# Altium schematic sheet ArduHoop.SchDoc
size B
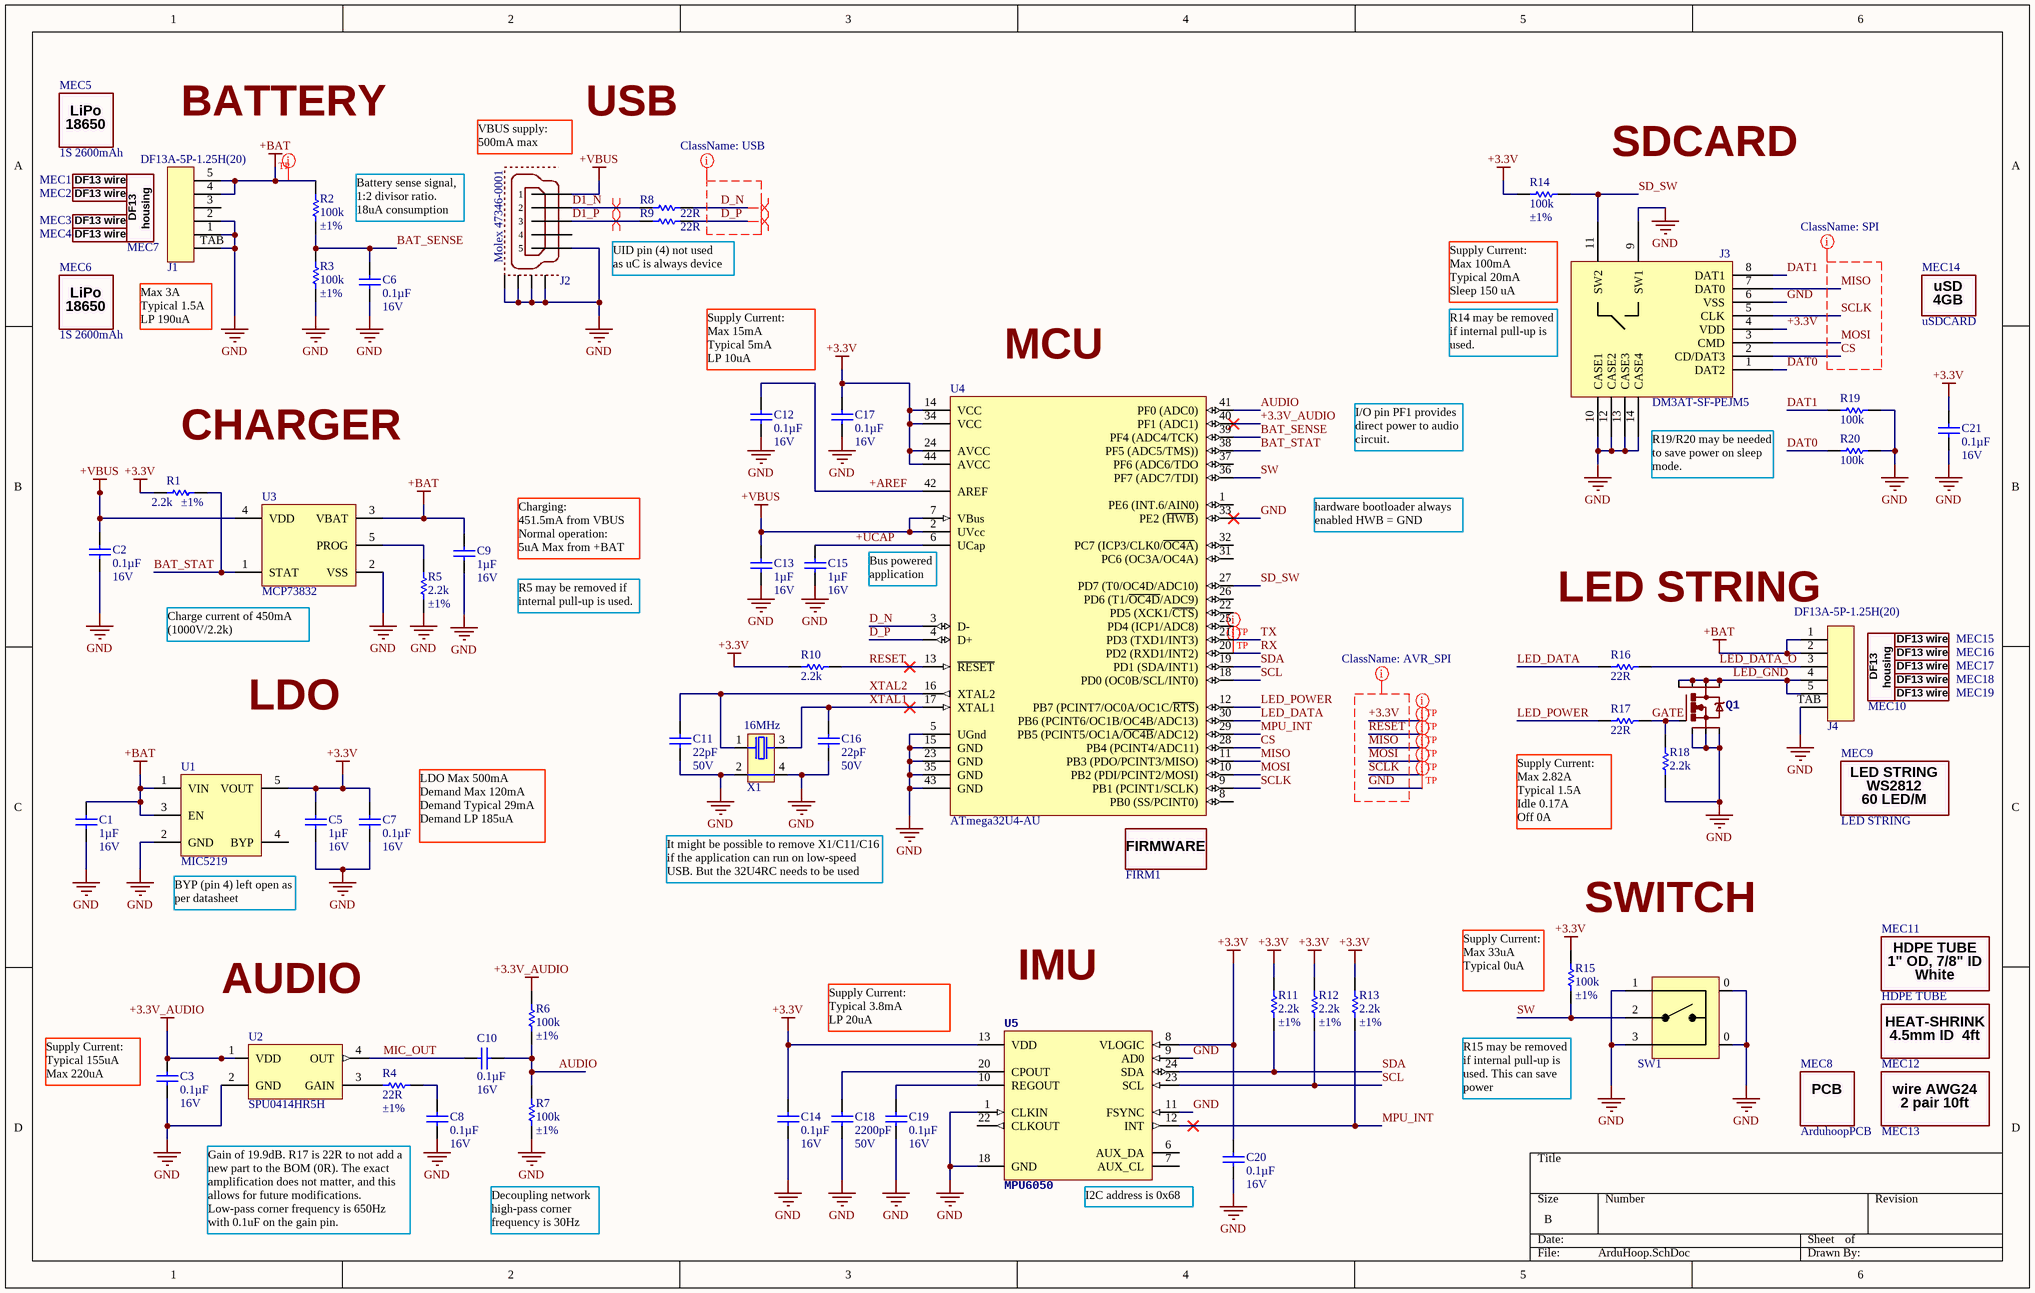
[diagram p0: ArduHoop.SchDoc]

## Parts
C1  value 1µF  Voltage: 16V  [C0603]  (hidden comment: CAP)
C2  value 0.1µF  Voltage: 16V  [C0603]  (hidden comment: CAP)
C3  value 0.1µF  Voltage: 16V  [C0603]  (hidden comment: CAP)
C5  value 1µF  Voltage: 16V  [C0603]  (hidden comment: CAP)
C6  value 0.1µF  Voltage: 16V  [C0603]  (hidden comment: CAP)
C7  value 0.1µF  Voltage: 16V  [C0603]  (hidden comment: CAP)
C8  value 0.1µF  Voltage: 16V  [C0603]  (hidden comment: CAP)
C9  value 1µF  Voltage: 16V  [C0603]  (hidden comment: CAP)
C10  value 0.1µF  Voltage: 16V  [C0603]  (hidden comment: CAP)
C11  value 22pF  Voltage: 50V  [C0603]  (hidden comment: CAP)
C12  value 0.1µF  Voltage: 16V  [C0603]  (hidden comment: CAP)
C13  value 1µF  Voltage: 16V  [C0603]  (hidden comment: CAP)
C14  value 0.1µF  Voltage: 16V  [C0603]  (hidden comment: CAP)
C15  value 1µF  Voltage: 16V  [C0603]  (hidden comment: CAP)
C16  value 22pF  Voltage: 50V  [C0603]  (hidden comment: CAP)
C17  value 0.1µF  Voltage: 16V  [C0603]  (hidden comment: CAP)
C18  value 2200pF  Voltage: 50V  [C0603]  (hidden comment: CAP)
C19  value 0.1µF  Voltage: 16V  [C0603]  (hidden comment: CAP)
C20  value 0.1µF  Voltage: 16V  [C0603]  (hidden comment: CAP)
C21  value 0.1µF  Voltage: 16V  [C0603]  (hidden comment: CAP)
FIRM1  FIRMWARE  (value not drawn)  (mechanical)
J1  Manufacturer Part Number: DF13A-5P-1.25H(20)  [DF13A-5P-1.25H]  (hidden comment: HDR_TAB_1x5)
J2  Molex 47346-0001  [Molex 47346-0001]
J3  DM3AT-SF-PEJM5  [USD_DM3AT]
J4  Manufacturer Part Number: DF13A-5P-1.25H(20)  [DF13A-5P-1.25H]  (hidden comment: HDR_TAB_1x5)
MEC1  wire5inch-df13  (value not drawn)  (mechanical)
MEC2  wire5inch-df13  (value not drawn)  (mechanical)
MEC3  wire5inch-df13  (value not drawn)  (mechanical)
MEC4  wire5inch-df13  (value not drawn)  (mechanical)
MEC5  1S 2600mAh  (mechanical)
MEC6  1S 2600mAh  (mechanical)
MEC7  df13housing  (value not drawn)  (mechanical)
MEC8  ArduhoopPCB  (mechanical)
MEC9  LED STRING  (mechanical)
MEC10  df13housing  (value not drawn)  (mechanical)
MEC11  HDPE TUBE  (mechanical)
MEC12  heatshrink  (value not drawn)  (mechanical)
MEC13  WIRE AWG24  (value not drawn)  (mechanical)
MEC14  uSDCARD  (mechanical)
MEC15  wire5inch-df13  (value not drawn)  (mechanical)
MEC16  wire5inch-df13  (value not drawn)  (mechanical)
MEC17  wire5inch-df13  (value not drawn)  (mechanical)
MEC18  wire5inch-df13  (value not drawn)  (mechanical)
MEC19  wire5inch-df13  (value not drawn)  (mechanical)
Q1  MOSFET_N  [SO-8]  (value not drawn)
R1  value 2.2k  Tolerance: ±1%  [R0603]  (hidden comment: RES)
R2  value 100k  Tolerance: ±1%  [R0603]  (hidden comment: RES)
R3  value 100k  Tolerance: ±1%  [R0603]  (hidden comment: RES)
R4  value 22R  Tolerance: ±1%  [R0603]  (hidden comment: RES)
R5  value 2.2k  Tolerance: ±1%  [R0603]  (hidden comment: RES)
R6  value 100k  Tolerance: ±1%  [R0603]  (hidden comment: RES)
R7  value 100k  Tolerance: ±1%  [R0603]  (hidden comment: RES)
R8  value 22R  [R0603]  (hidden comment: RES)
R9  value 22R  [R0603]  (hidden comment: RES)
R10  value 2.2k  [R0603]  (hidden comment: RES)
R11  value 2.2k  Tolerance: ±1%  [R0603]  (hidden comment: RES)
R12  value 2.2k  Tolerance: ±1%  [R0603]  (hidden comment: RES)
R13  value 2.2k  Tolerance: ±1%  [R0603]  (hidden comment: RES)
R14  value 100k  Tolerance: ±1%  [R0603]  (hidden comment: RES)
R15  value 100k  Tolerance: ±1%  [R0603]  (hidden comment: RES)
R16  value 22R  [R0603]  (hidden comment: RES)
R17  value 22R  [R0603]  (hidden comment: RES)
R18  value 2.2k  [R0603]  (hidden comment: RES)
R19  value 100k  [R0603]  (hidden comment: RES)
R20  value 100k  [R0603]  (hidden comment: RES)
SW1  EVPAE  [EVPAEJB2A]  (value not drawn)
U1  MIC5219  [SOT-23-5]
U2  SPU0414HR5H  [SPU0414HR5H]
U3  MCP73832  [SOT-23-5]
U4  ATmega32U4-AU  [ATMEL-TQFP44_ml]
U5  MPU6050  [QFN24_4X4X0.9mm]
X1  Frequency: 16MHz  [SMD4_3.2x2.50mm_ABM8]  (hidden comment: Crystal_4pin)

## Nets
+3.3V: C5.1 C7.1 C14.1 C17.1 C20.1 C21.1 J3.4(VDD) R1.1 R10.1 R11.1 R12.1 R13.1 R14.2 R15.2 U1.5(VOUT) U4.14(VCC) U4.24(AVCC) U4.34(VCC) U4.44(AVCC) U5.8(VLOGIC) U5.13(VDD)
+3.3V_AUDIO: C3.1 R6.2 U2.1(VDD) U4.40(PF1_(ADC1))
+BAT: C1.1 C9.1 J1.4 J1.5 J4.1 J4.2 R2.2 U1.1(VIN) U1.3(EN) U3.3(VBAT)
+VBUS: C2.1 C13.1 J2.VBUS(1) U3.4(VDD) U4.2(UVcc) U4.7(VBus)
GND: C1.2 C2.2 C3.2 C5.2 C6.2 C7.2 C8.2 C9.2 C11.2 C12.2 C13.2 C14.2 C15.2 C16.2 C17.2 C18.2 C19.2 C20.2 C21.2 J1.1 J1.2 J1.TAB J2.GND(5) J2.GND1 J2.GND2 J2.GND3 J2.GND4 J3.6(VSS) J3.9(SW1) J3.10(CASE1) J3.12(CASE2) J3.13(CASE3) J3.14(CASE4) J4.TAB Q1.1(S) Q1.2(S) Q1.3(S) R3.1 R5.2 R7.1 R18.2 R19.1 R20.1 SW1.0 SW1.1 SW1.3 U1.2(GND) U2.2(GND) U3.2(VSS) U4.5(UGnd) U4.15(GND) U4.23(GND) U4.33(PE2_(~{HWB})) U4.35(GND) U4.43(GND) U5.1(CLKIN) U5.9(AD0) U5.11(FSYNC) U5.18(GND) X1.2 X1.4
+AREF: C12.1 U4.42(AREF)
+UCAP: C15.1 U4.6(UCap)
AUDIO: C10.2 R6.1 R7.2 U4.41(PF0_(ADC0))
BAT_SENSE: C6.1 R2.1 R3.2 U4.39(PF4_(ADC4/TCK))
BAT_STAT: R1.2 U3.1(STAT) U4.38(PF5_(ADC5/TMS)))
CS: J3.2(CD/DAT3) U4.28(PB4_(PCINT4/ADC11))
D1_N: J2.D-(2) R8.1
D1_P: J2.D+(3) R9.1
D_N: R8.2 U4.3(D-)
D_P: R9.2 U4.4(D+)
DAT0: J3.1(DAT2) R20.2
DAT1: J3.8(DAT1) R19.2
GATE: Q1.4(G) R17.2 R18.1
LED_DATA: R16.1 U4.30(PB6_(PCINT6/OC1B/OC4B/ADC13))
LED_DATA_O: J4.3 R16.2
LED_GND: J4.4 J4.5 Q1.5(D) Q1.6(D) Q1.7(D) Q1.8(D)
LED_POWER: R17.1 U4.12(PB7_(PCINT7/OC0A/OC1C/~{RTS}))
MIC_OUT: C10.1 U2.4(OUT)
MISO: J3.7(DAT0) U4.11(PB3_(PDO/PCINT3/MISO))
MOSI: J3.3(CMD) U4.10(PB2_(PDI/PCINT2/MOSI))
MPU_INT: R13.2 U4.29(PB5_(PCINT5/OC1A/~{OC4B}/ADC12)) U5.12(INT)
RESET: R10.2 U4.13(~{RESET})
RX: U4.20(PD2_(RXD1/INT2))
SCL: R12.2 U4.18(PD0_(OC0B/SCL/INT0)) U5.23(SCL)
SCLK: J3.5(CLK) U4.9(PB1_(PCINT1/SCLK))
SD_SW: J3.11(SW2) R14.1 U4.27(PD7_(T0/OC4D/ADC10))
SDA: R11.2 U4.19(PD1_(SDA/INT1)) U5.24(SDA)
SW: R15.1 SW1.2 U4.36(PF7_(ADC7/TDI))
TX: U4.21(PD3_(TXD1/INT3))
XTAL1: C16.1 U4.17(XTAL1) X1.3
XTAL2: C11.1 U4.16(XTAL2) X1.1
NetC8_1: C8.1 R4.2
NetC18_1: C18.1 U5.20(CPOUT)
NetC19_1: C19.1 U5.10(REGOUT)
NetR4_1: R4.1 U2.3(GAIN)
NetR5_1: R5.1 U3.5(PROG)

Not connected (* = marked no-connect by the designer): J1 3; J2 ID(4); U1 4(BYP); U4 1(PE6_(INT.6/AIN0)) 8(PB0_(SS/PCINT0)) 22(PD5_(XCK1/~{CTS})) 25(PD4_(ICP1/ADC8)) 26(PD6_(T1/~{OC4D}/ADC9)) 31(PC6_(OC3A/OC4A)) 32(PC7_(ICP3/CLK0/~{OC4A})) 37(PF6_(ADC6/TDO); U5 6(AUX_DA) 7(AUX_CL) 22(CLKOUT)

## Layout directives
net class SPI: CS, MISO, MOSI, SCLK
net class TP: +3.3V, +BAT, GND, MISO, MOSI, RESET, RX, SCLK, TX
differential pair: D1_N, D1_P, D_N, D_P
net class USB: D_N, D_P
net class AVR_SPI: +3.3V, GND, MISO, MOSI, RESET, SCLK

## Notes on the sheet
- BATTERY
- (near J2) VBUS supply:
  500mA max
- USB
- SDCARD
- Battery sense signal, 1:2 divisor ratio. 18uA consumption
- UID pin (4) not used
  as uC is always device
- Supply Current:
  Max 100mA
  Typical 20mA
  Sleep 150 uA
- Max 3A
  Typical 1.5A
  LP 190uA
- Supply Current:
  Max 15mA
  Typical 5mA
  LP 10uA
- (near U4) MCU
- (near J3) R14 may be removed if internal pull-up is used.
- (near R1) CHARGER
- I/O pin PF1 provides direct power to audio circuit.
- (near J3) R19/R20 may be needed to save power on sleep mode.
- Charging:
  451.5mA from VBUS
  Normal operation:
  5uA Max from +BAT
- hardware bootloader always enabled HWB = GND
- (near U3) Charge current of 450mA (1000V/2.2k)
- R5 may be removed if internal pull-up is used.
- (near U4) Bus powered application
- LED STRING
- LDO
- (near C7) LDO Max 500mA
  Demand Max 120mA
  Demand Typical 29mA
  Demand LP 185uA
- Supply Current:
  Max 2.82A
  Typical 1.5A
  Idle 0.17A
  Off 0A
- BYP (pin 4) left open as per datasheet
- It might be possible to remove X1/C11/C16 if the application can run on low-speed USB. But the 32U4RC needs to be used
- SWITCH
- AUDIO
- Supply Current:
  Typical 3.8mA
  LP 20uA
- IMU
- (near R15) Supply Current:
  Max 33uA
  Typical 0uA
- (near C3) Supply Current:
  Typical 155uA
  Max 220uA
- (near R15) R15 may be removed if internal pull-up is used. This can save power
- (near C8) Gain of 19.9dB. R17 is 22R to not add a new part to the BOM (0R). The exact amplification does not matter, and this allows for future modifications. Low-pass corner frequency is 650Hz with 0.1uF on the gain pin.
- Decoupling network high-pass corner frequency is 30Hz
- (near U5) I2C address is 0x68
- (in symbol df13housing) housing; DF13
- (in symbol heatshrink) HEAT-SHRINK; 4.5mm ID  4ft
- (in symbol LED_STRING1) WS2812; 60 LED/M; uSD; 4GB
- (in symbol LiPo_18650_2600mAh) LiPo; 18650
- (in symbol TUBE_HDPE) 1" OD, 7/8" ID; White
- (in symbol wire5inch-df13) DF13 wire
- (in symbol WIRE_AWG24) wire AWG24; 2 pair 10ft

## Library data of the parts
C1 C5 C9 C13 C15 = C01293: CAP CER 1UF 16V X7R 0603; Part Number: C01293; Manufacturer: Murata Electronics North America; Manufacturer Part Number: GRM188R71C105KA12D; Tolerance: ±10%; Supplier 1: Digi-Key; Supplier Part Number 1: 490-3900-1-ND; HelpURL: http://www.murata.com/~/media/webrenewal/support/library/catalog/products/capacitor/mlcc/c02e.ashx; Operating Temperature: -55°C ~ 125°C; Type: CER; Temperature Coefficient: X7R
C2 C3 C6-C8 C10 C12 C14 C17 C19-C21 = C01052: CAP CER 0.1UF 16V X7R 0603; Part Number: C01052; Manufacturer: Murata Electronics North America; Manufacturer Part Number: GRM188R71C104KA01D; Tolerance: ±10%; Supplier 1: Digi-Key; Supplier Part Number 1: 490-1532-1-ND; HelpURL: http://www.murata.com/~/media/webrenewal/support/library/catalog/products/capacitor/mlcc/c02e.ashx; Operating Temperature: -55°C ~ 125°C; Type: CER; Temperature Coefficient: X7R
C11 C16 = C00144: CAP CER 22PF 50V NP0 0603; Part Number: C00144; Manufacturer: Murata Electronics North America; Manufacturer Part Number: GRM1885C1H220JA01D; Tolerance: ±5%; Temperature Coefficient: C0G, NP0; Supplier 1: Digi-Key; Supplier Part Number 1: 490-1411-1-ND; HelpURL: http://www.murata.com/~/media/webrenewal/support/library/catalog/products/capacitor/mlcc/c02e.ashx; Operating Temperature: -55°C ~ 125°C; Type: CER
C18 = C00648: CAP CER 2200PF 50V X7R 0603; Part Number: C00648; Manufacturer: Murata Electronics North America; Manufacturer Part Number: GRM188R71H222KA01D; Tolerance: ±10%; Supplier 1: Digi-Key; Supplier Part Number 1: 490-1500-1-ND; HelpURL: http://www.murata.com/~/media/webrenewal/support/library/catalog/products/capacitor/mlcc/c02e.ashx; Operating Temperature: -55°C ~ 125°C; Type: CER; Temperature Coefficient: X7R
J1 J4 = J00022: CONN HEADER 5POS 1.25MM R/A TIN; Part Number: J00022; Manufacturer: Hirose Electric Co Ltd; Connector Type: Header, Shrouded; Number of Positions: 5; Current Rating: 1A; Voltage - Rated: 150V; Series: DF13; Supplier 1: Digi-Key; Contact Type: Male Pin; Mounting Type: Surface Mount, Right Angle; Supplier Part Number 1: H3370-ND; HelpURL: http://www.hirose.co.jp/cataloge_hp/2d/EDCX3-084905-02.pdf; Pitch: 1.25mm; Operating Temperature: -35°C ~ 85°C; Contact Finish: Tin; Housing Color: Beige; Number of Rows: 1
J2 = USB: Supplier 1: Digi-Key; Supplier Part Number 1: WM17141CT-ND
J3 = J00167: CONN MICRO SD CARD PUSH-PUSH R/A; Part Number: J00167; Manufacturer: Hirose Electric Co Ltd; Connector Type: Socket, microSD; Number of Positions: 10 (8 + 2); Manufacturer Part Number: DM3AT-SF-PEJM5; Series: DM3; Supplier 1: Digi-Key; Contact Type: Female; Mounting Type: Surface Mount, Right Angle; Supplier Part Number 1: HR1964CT-ND; HelpURL: http://www.hirose.co.jp/cataloge_hp/e60900232.pdf; Pitch: -; Operating Temperature: -25°C ~ 85°C; Current Rating: -; Voltage - Rated: -; Contact Finish: Gold; Housing Color: Metal; Number of Rows: -; Insertion Removal Method: push-push
MEC1-MEC4 MEC15-MEC19 = wire5inch-df13: DF13 pre-crimped 5" wire; Manufacturer: Hirose Electric Co Ltd; Manufacturer Part Number: H4BXG-10105-W6; Supplier 1: Digi-Key; Supplier Part Number 1: H4BXG-10105-W6-ND
MEC5 MEC6 = LiPo_18650_2600mAh: Tenergy Li-Ion 18650 3.7V 2600mAh; Manufacturer Part Number: 30011; Supplier 1: Amazon; Supplier Part Number 1: B003U7SUUM; Manufacturer: Tenergy; Operating Temperature: -55°C ~ 155°C; HelpURL: http://www.amazon.com/gp/product/B003U7SUUM
MEC7 MEC10 = df13housing: DF13 housing 5pos; Manufacturer: Hirose Electric Co Ltd; Manufacturer Part Number: H4BXG-10105-W6; Supplier 1: Digi-Key; Supplier Part Number 1: H2182-ND
MEC8 = PCB
MEC9 = LED_STRING1: LED Strip WS2812B 60 LEDs/meter; Supplier 1: Amazon; Supplier Part Number 1: B00LUAKB62; HelpURL: http://www.amazon.com/gp/product/B00LUAKB62
MEC11 = TUBE_HDPE: HDPE TUBE 1" OD, 7/8" ID White 10 ft; Supplier 1: McMaster; Supplier Part Number 1: 50375K58; HelpURL: http://www.mcmaster.com/#50375k58/
MEC12 = heatshrink: HEAT-SHRINK 3/16" ID Before, 3/32" ID After, 4' Length; Supplier 1: McMaster; Supplier Part Number 1: 7856K14; HelpURL: http://www.mcmaster.com/#7856k14
MEC13 = WIRE_AWG24: WIRE AWG24 2 conductors; Supplier 1: McMaster; Supplier Part Number 1: 9697T1; HelpURL: http://www.mcmaster.com/#9697t1/
MEC14 = LED_STRING1: Sandisk 4GB microSDHC Card Class 2; Supplier 1: Amazon; Supplier Part Number 1: B002T8GP8M; HelpURL: http://www.amazon.com/Sandisk-microSDHC-SDSDQ-004G-Package-microSD/dp/B002T8GP8M/
Q1 = Q000008: MOSFET P-CH 30V 5.8A 8-SOIC; Manufacturer Part Number: IRF7406TRPBF; Manufacturer: Infineon Technologies Americas Corp.; FET Type: MOSFET P-Channel, Metal Oxide; FET Feature: Standard; Current - Continuous Drain (Id) @ 25°C: 5.8A (Ta); Rds On (Max) @ Id, Vgs: 45 mOhm @ 2.8A, 10V; Vgs(th) (Max) @ Id: 1V @ 250µA; Gate Charge (Qg) @ Vgs: 59nC @ 10V; Input Capacitance (Ciss) @ Vds: 1100pF @ 25V; Power - Max: 2.5W; Part Number: Q000008; HelpURL: http://www.irf.com/product-info/datasheets/data/irf7406pbf.pdf; Supplier 1: Digi-Key; Supplier Part Number 1: IRF7406PBFCT-ND; Drain to Source Voltage (Vdss): 30V; Operating Temperature: -55°C ~ 150°C (TJ)
R1 R5 R10-R13 R18 = R00109: RES SMD 2.2K OHM 1% 1/10W 0603; Part Number: R00109; Manufacturer: Yageo; Manufacturer Part Number: RC0603FR-072K2L; Temperature Coefficient: ±100ppm/°C; Supplier 1: Digi-Key; Supplier Part Number 1: 311-2.20KHRCT-ND; HelpURL: http://www.yageo.com/NewPortal/yageodocoutput?fileName=/pdf/R-Chip/PYu-RC_Group_51_RoHS_L_3.pdf; Power: 1/10W; Operating Temperature: -55°C ~ 155°C
R2 R3 R6 R7 R14 R15 R19 R20 = R00189: RES SMD 100K OHM 1% 1/10W 0603; Part Number: R00189; Manufacturer: Yageo; Manufacturer Part Number: RC0603FR-07100KL; Temperature Coefficient: ±100ppm/°C; Supplier 1: Digi-Key; Supplier Part Number 1: 311-100KHRCT-ND; HelpURL: http://www.yageo.com/NewPortal/yageodocoutput?fileName=/pdf/R-Chip/PYu-RC_Group_51_RoHS_L_3.pdf; Power: 1/10W; Operating Temperature: -55°C ~ 155°C
R4 R8 R9 R16 R17 = R00015: RES SMD 22 OHM 1% 1/10W 0603; Part Number: R00015; Manufacturer: Yageo; Manufacturer Part Number: RC0603FR-0722RL; Temperature Coefficient: ±100ppm/°C; Supplier 1: Digi-Key; Supplier Part Number 1: 311-22.0HRCT-ND; HelpURL: http://www.yageo.com/NewPortal/yageodocoutput?fileName=/pdf/R-Chip/PYu-RC_Group_51_RoHS_L_3.pdf; Power: 1/10W; Operating Temperature: -55°C ~ 155°C
  R8 R9: Tolerance: ±1%
SW1 = SW000001: SWITCH TACTILE SPST-NO 0.02A 15V; Manufacturer: Panasonic Electronic Components; Manufacturer Part Number: r / EVP-AEJB2A; Switch Function: Off-Mom; Contact Rating: 0.02A @ 15VDC; Actuator height: 1.70mm; Actuator Orientation: Side Actuated; Illumination: Non-Illuminated; Operating Force: 350gf; Part Number: SW000001; Supplier 1: Digi-key; Supplier Part Number 1: P17697CT-ND; HelpURL: http://industrial.panasonic.com/cdbs/www-data/pdf/ATK0000/ATK0000CE37.pdf; Series: EVPAE; Circuit: SPST-NO; Mounting Type: Edge Mount, Right Angl
U1 = PMIC000001: IC REG LDO 3.3V 0.5A SOT23-5; Manufacturer Part Number: MIC5219-3.3YM5-TR; Manufacturer: Microchip Technology; Regulator Topology: Positive Fixed; Current - Output: 500mA; Voltage - Dropout (Typical): 0.35V @ 500mA; Number of Regulators: 1; Voltage - Input: Up to 12V; Part Number: PMIC000001; HelpURL: http://www.microchip.com/mymicrochip/filehandler.aspx?ddocname=en579712; Supplier 1: Digi-Key; Supplier Part Number 1: 576-1281-1-ND; Voltage - Output: 3.3V; Current - Limit (Min): -; Operating Temperature: -40°C ~ 125°C
U2 = P000005: MIC MEMS ANALOG OMNI -22DB; Manufacturer Part Number: SPU0414HR5H-SB-7; Manufacturer: Knowles; Part Number: P000005; HelpURL: http://www.knowles.com/eng/content/download/3915/49630/version/7/file/SPU0414HR5H-SB.pdf; Supplier 1: Digi-Key; Supplier Part Number 1: 423-1134-1-ND; Operating Temperature: -40°C ~ 100°C
U3 = P000002: IC LI-ION/LI-POLY CTRLR SOT23-5; Manufacturer Part Number: MCP73832T-2ATI/OT; Manufacturer: Microchip Technology; Part Number: P000002; HelpURL: http://www.microchip.com/mymicrochip/filehandler.aspx?ddocname=en025112; Supplier 1: Digi-Key; Supplier Part Number 1: MCP73832T-2ATI/OTCT-ND; Operating Temperature: -40°C ~ 85°C
U4 = MCU00751: IC MCU 8BIT 32KB FLASH 44TQFP; Manufacturer Part Number: ATMEGA32U4-AUR; Manufacturer: Atmel; Core Processor: AVR; Core Size: 8-Bit; Speed: 16MHz; Program Memory Size: 32KB (16K x 16); RAM Size: 2.5K x 8; EEPROM Size: 1K x 8; Number of I/O: 26; Analog to Digital Converter: 10b; UART: yes; LIN: no; DatasheetVersion: revF, Nov-2010; PackageVersion: rev.G, Jul-2007; PackageReference: 44ML; PackageDescription: 44-Pin Plastic Thin Quad Flat Pack, 10 x 10 x 1.0 mm Body, 0.8 mm Pitch (TQFP); ComponentLink1Description: Manufacturer URL; ComponentLink1URL: http://www.atmel.com/; ComponentLink2Description: ATmega16U4/32U4 Datasheet; ComponentLink2URL: http://www.atmel.com/dyn/resources/prod_documents/doc7766.pdf; ComponentLink3Description: ATmega16U4 ATmega32U4 Summary; ComponentLink3URL: http://www.atmel.com/dyn/resources/prod_documents/7766S.pdf; Part Number: MCU00751; HelpURL: http://media.digikey.com/pdf/Data%20Sheets/Atmel%20PDFs/ATmega16U4,32U4.pdf; Supplier 1: Digi-Key; Supplier Part Number 1: ATMEGA32U4-AURCT-ND; Series: AVR® ATmega; Operating Temperature: -40°C ~ 85°C (TA); Digital to Analog Converter: -; SPI: yes; I2C: yes; CAN: no; I2S: no; USB: yes; Ethernet: no
U5 = P000004: GYRO/ACCELEROMETER 6AXIS 24QFN; Manufacturer: InvenSense; Part Number: P000004; HelpURL: http://store.invensense.com/datasheets/invensense/MPU-6050_DataSheet_V3%204.pdf; Supplier 1: Digi-Key; Supplier Part Number 1: 1428-1007-1-ND; Manufacturer Part Number: MPU-6050; Operating Temperature: -40°C ~ 85°C
X1 = Q00342: CRYSTAL 16.0000MHZ 18PF SMD; Part Number: Q00342; Manufacturer Part Number: ABM8-16.000MHZ-B2-T; Manufacturer: Abracon LLC; Frequency Stability: ±50ppm; Frequency Tolerance: ±20ppm; Impedance: 70 Ohm; HelpURL: http://www.abracon.com/Resonators/abm8.pdf; Supplier 1: Digi-Key; Supplier Part Number 1: 535-9134-1-ND; Series: ABM8; Type: MHz Crystal; Features: -; Capacitance: 18pF; Operating Temperature: -20°C ~ 70°C